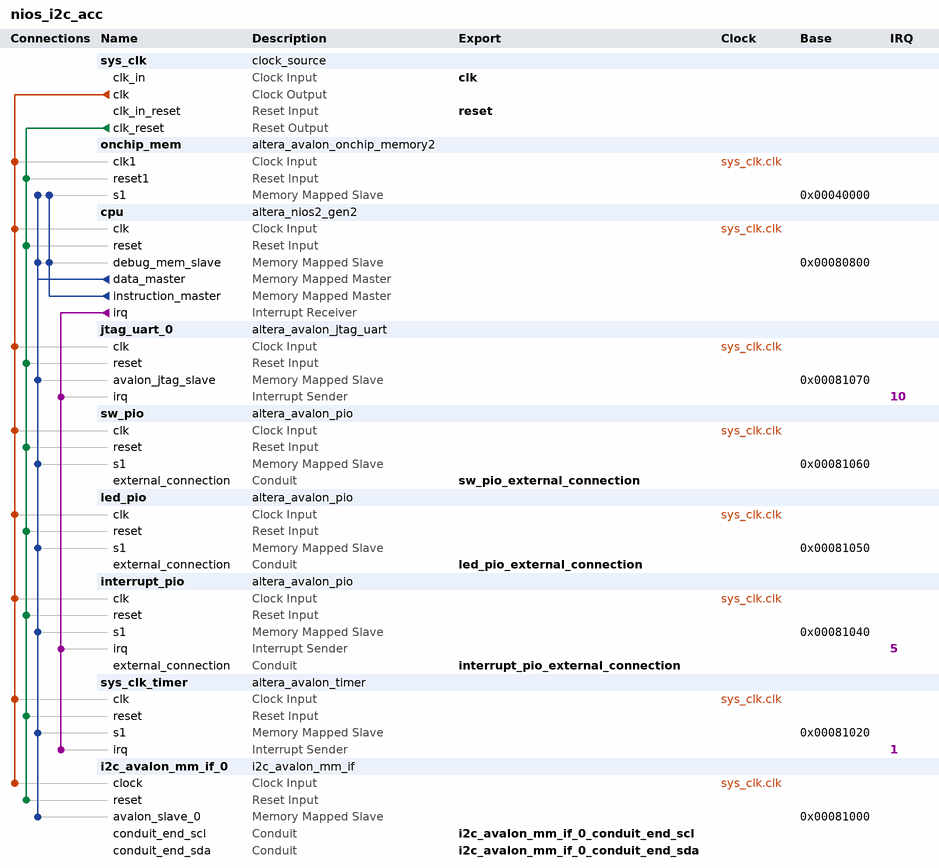
[diagram p0: system contents]
# Platform Designer (Qsys) system nios_i2c_acc, MAX 10 10M50DAF484C6GES
# Parameters at their usual value, and those the tool derives, are not listed.
package require -exact qsys 22.1
create_system nios_i2c_acc
set_project_property DEVICE_FAMILY {MAX 10}
set_project_property DEVICE 10M50DAF484C6GES

add_instance sys_clk clock_source 22.1
set_instance_parameter_value sys_clk clockFrequency 50000000

add_instance onchip_mem altera_avalon_onchip_memory2 22.1
set_instance_parameter_value onchip_mem dataWidth 32
set_instance_parameter_value onchip_mem dualPort false
set_instance_parameter_value onchip_mem initMemContent true
set_instance_parameter_value onchip_mem initializationFileName onchip_mem.hex
set_instance_parameter_value onchip_mem memorySize 153600

add_instance cpu altera_nios2_gen2 22.1
set_instance_parameter_value cpu dcache_size 2048
set_instance_parameter_value cpu exceptionSlave onchip_mem.s1
set_instance_parameter_value cpu icache_size 4096
set_instance_parameter_value cpu impl Fast
set_instance_parameter_value cpu resetSlave onchip_mem.s1

add_instance jtag_uart_0 altera_avalon_jtag_uart 22.1
set_instance_parameter_value jtag_uart_0 simInteractiveOptions NO_INTERACTIVE_WINDOWS

add_instance sw_pio altera_avalon_pio 22.1
set_instance_parameter_value sw_pio direction Input
set_instance_parameter_value sw_pio width 10

add_instance led_pio altera_avalon_pio 22.1
set_instance_parameter_value led_pio direction Output
set_instance_parameter_value led_pio width 10

add_instance interrupt_pio altera_avalon_pio 22.1
set_instance_parameter_value interrupt_pio captureEdge true
set_instance_parameter_value interrupt_pio direction Input
set_instance_parameter_value interrupt_pio edgeType FALLING
set_instance_parameter_value interrupt_pio generateIRQ true
set_instance_parameter_value interrupt_pio irqType EDGE
set_instance_parameter_value interrupt_pio width 3

add_instance sys_clk_timer altera_avalon_timer 22.1
set_instance_parameter_value sys_clk_timer period 1
set_instance_parameter_value sys_clk_timer periodUnits SEC

add_instance i2c_avalon_mm_if_0 i2c_avalon_mm_if 1.0
set_instance_parameter_value i2c_avalon_mm_if_0 GC_I2C_CLK 200000
set_instance_parameter_value i2c_avalon_mm_if_0 GC_SYSTEM_CLK 50000000

# connections
add_connection sys_clk.clk cpu.clk clock
add_connection sys_clk.clk i2c_avalon_mm_if_0.clock clock
add_connection sys_clk.clk interrupt_pio.clk clock
add_connection sys_clk.clk jtag_uart_0.clk clock
add_connection sys_clk.clk led_pio.clk clock
add_connection sys_clk.clk onchip_mem.clk1 clock
add_connection sys_clk.clk sw_pio.clk clock
add_connection sys_clk.clk sys_clk_timer.clk clock
add_connection sys_clk.clk_reset cpu.reset reset
add_connection sys_clk.clk_reset i2c_avalon_mm_if_0.reset reset
add_connection sys_clk.clk_reset interrupt_pio.reset reset
add_connection sys_clk.clk_reset jtag_uart_0.reset reset
add_connection sys_clk.clk_reset led_pio.reset reset
add_connection sys_clk.clk_reset onchip_mem.reset1 reset
add_connection sys_clk.clk_reset sw_pio.reset reset
add_connection sys_clk.clk_reset sys_clk_timer.reset reset
add_connection cpu.data_master cpu.debug_mem_slave avalon
set_connection_parameter_value cpu.data_master/cpu.debug_mem_slave baseAddress 0x00080800
add_connection cpu.data_master i2c_avalon_mm_if_0.avalon_slave_0 avalon
set_connection_parameter_value cpu.data_master/i2c_avalon_mm_if_0.avalon_slave_0 baseAddress 0x00081000
add_connection cpu.data_master interrupt_pio.s1 avalon
set_connection_parameter_value cpu.data_master/interrupt_pio.s1 baseAddress 0x00081040
add_connection cpu.data_master jtag_uart_0.avalon_jtag_slave avalon
set_connection_parameter_value cpu.data_master/jtag_uart_0.avalon_jtag_slave baseAddress 0x00081070
add_connection cpu.data_master led_pio.s1 avalon
set_connection_parameter_value cpu.data_master/led_pio.s1 baseAddress 0x00081050
add_connection cpu.data_master onchip_mem.s1 avalon
set_connection_parameter_value cpu.data_master/onchip_mem.s1 baseAddress 0x00040000
add_connection cpu.data_master sw_pio.s1 avalon
set_connection_parameter_value cpu.data_master/sw_pio.s1 baseAddress 0x00081060
add_connection cpu.data_master sys_clk_timer.s1 avalon
set_connection_parameter_value cpu.data_master/sys_clk_timer.s1 baseAddress 0x00081020
add_connection cpu.instruction_master cpu.debug_mem_slave avalon
set_connection_parameter_value cpu.instruction_master/cpu.debug_mem_slave baseAddress 0x00080800
add_connection cpu.instruction_master onchip_mem.s1 avalon
set_connection_parameter_value cpu.instruction_master/onchip_mem.s1 baseAddress 0x00040000
add_connection cpu.irq interrupt_pio.irq interrupt
set_connection_parameter_value cpu.irq/interrupt_pio.irq irqNumber 5
add_connection cpu.irq jtag_uart_0.irq interrupt
set_connection_parameter_value cpu.irq/jtag_uart_0.irq irqNumber 10
add_connection cpu.irq sys_clk_timer.irq interrupt
set_connection_parameter_value cpu.irq/sys_clk_timer.irq irqNumber 1

# exported interfaces
add_interface clk clock sink
set_interface_property clk EXPORT_OF sys_clk.clk_in
add_interface i2c_avalon_mm_if_0_conduit_end_scl conduit end
set_interface_property i2c_avalon_mm_if_0_conduit_end_scl EXPORT_OF i2c_avalon_mm_if_0.conduit_end_scl
add_interface i2c_avalon_mm_if_0_conduit_end_sda conduit end
set_interface_property i2c_avalon_mm_if_0_conduit_end_sda EXPORT_OF i2c_avalon_mm_if_0.conduit_end_sda
add_interface interrupt_pio_external_connection conduit end
set_interface_property interrupt_pio_external_connection EXPORT_OF interrupt_pio.external_connection
add_interface led_pio_external_connection conduit end
set_interface_property led_pio_external_connection EXPORT_OF led_pio.external_connection
add_interface reset reset sink
set_interface_property reset EXPORT_OF sys_clk.clk_in_reset
add_interface sw_pio_external_connection conduit end
set_interface_property sw_pio_external_connection EXPORT_OF sw_pio.external_connection

set_interconnect_requirement {$system} qsys_mm.clockCrossingAdapter HANDSHAKE
set_interconnect_requirement {$system} qsys_mm.enableEccProtection FALSE
set_interconnect_requirement {$system} qsys_mm.insertDefaultSlave FALSE
set_interconnect_requirement {$system} qsys_mm.maxAdditionalLatency 1

save_system nios_i2c_acc.qsys
